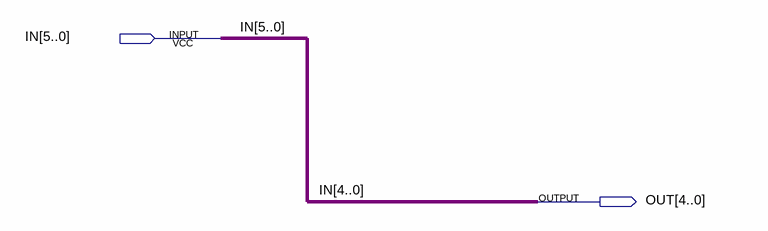
[diagram p0: schematic sheet]
// Quartus schematic Transform5for4.bdf as structural Verilog: 0 symbols, 2 pins
module Transform5for4 (
  input  [5:0] IN,
  output [4:0] OUT
);


  assign OUT = IN[4:0];
endmodule
